# EAGLE design emg-bridge (EAGLE 6.5.0)
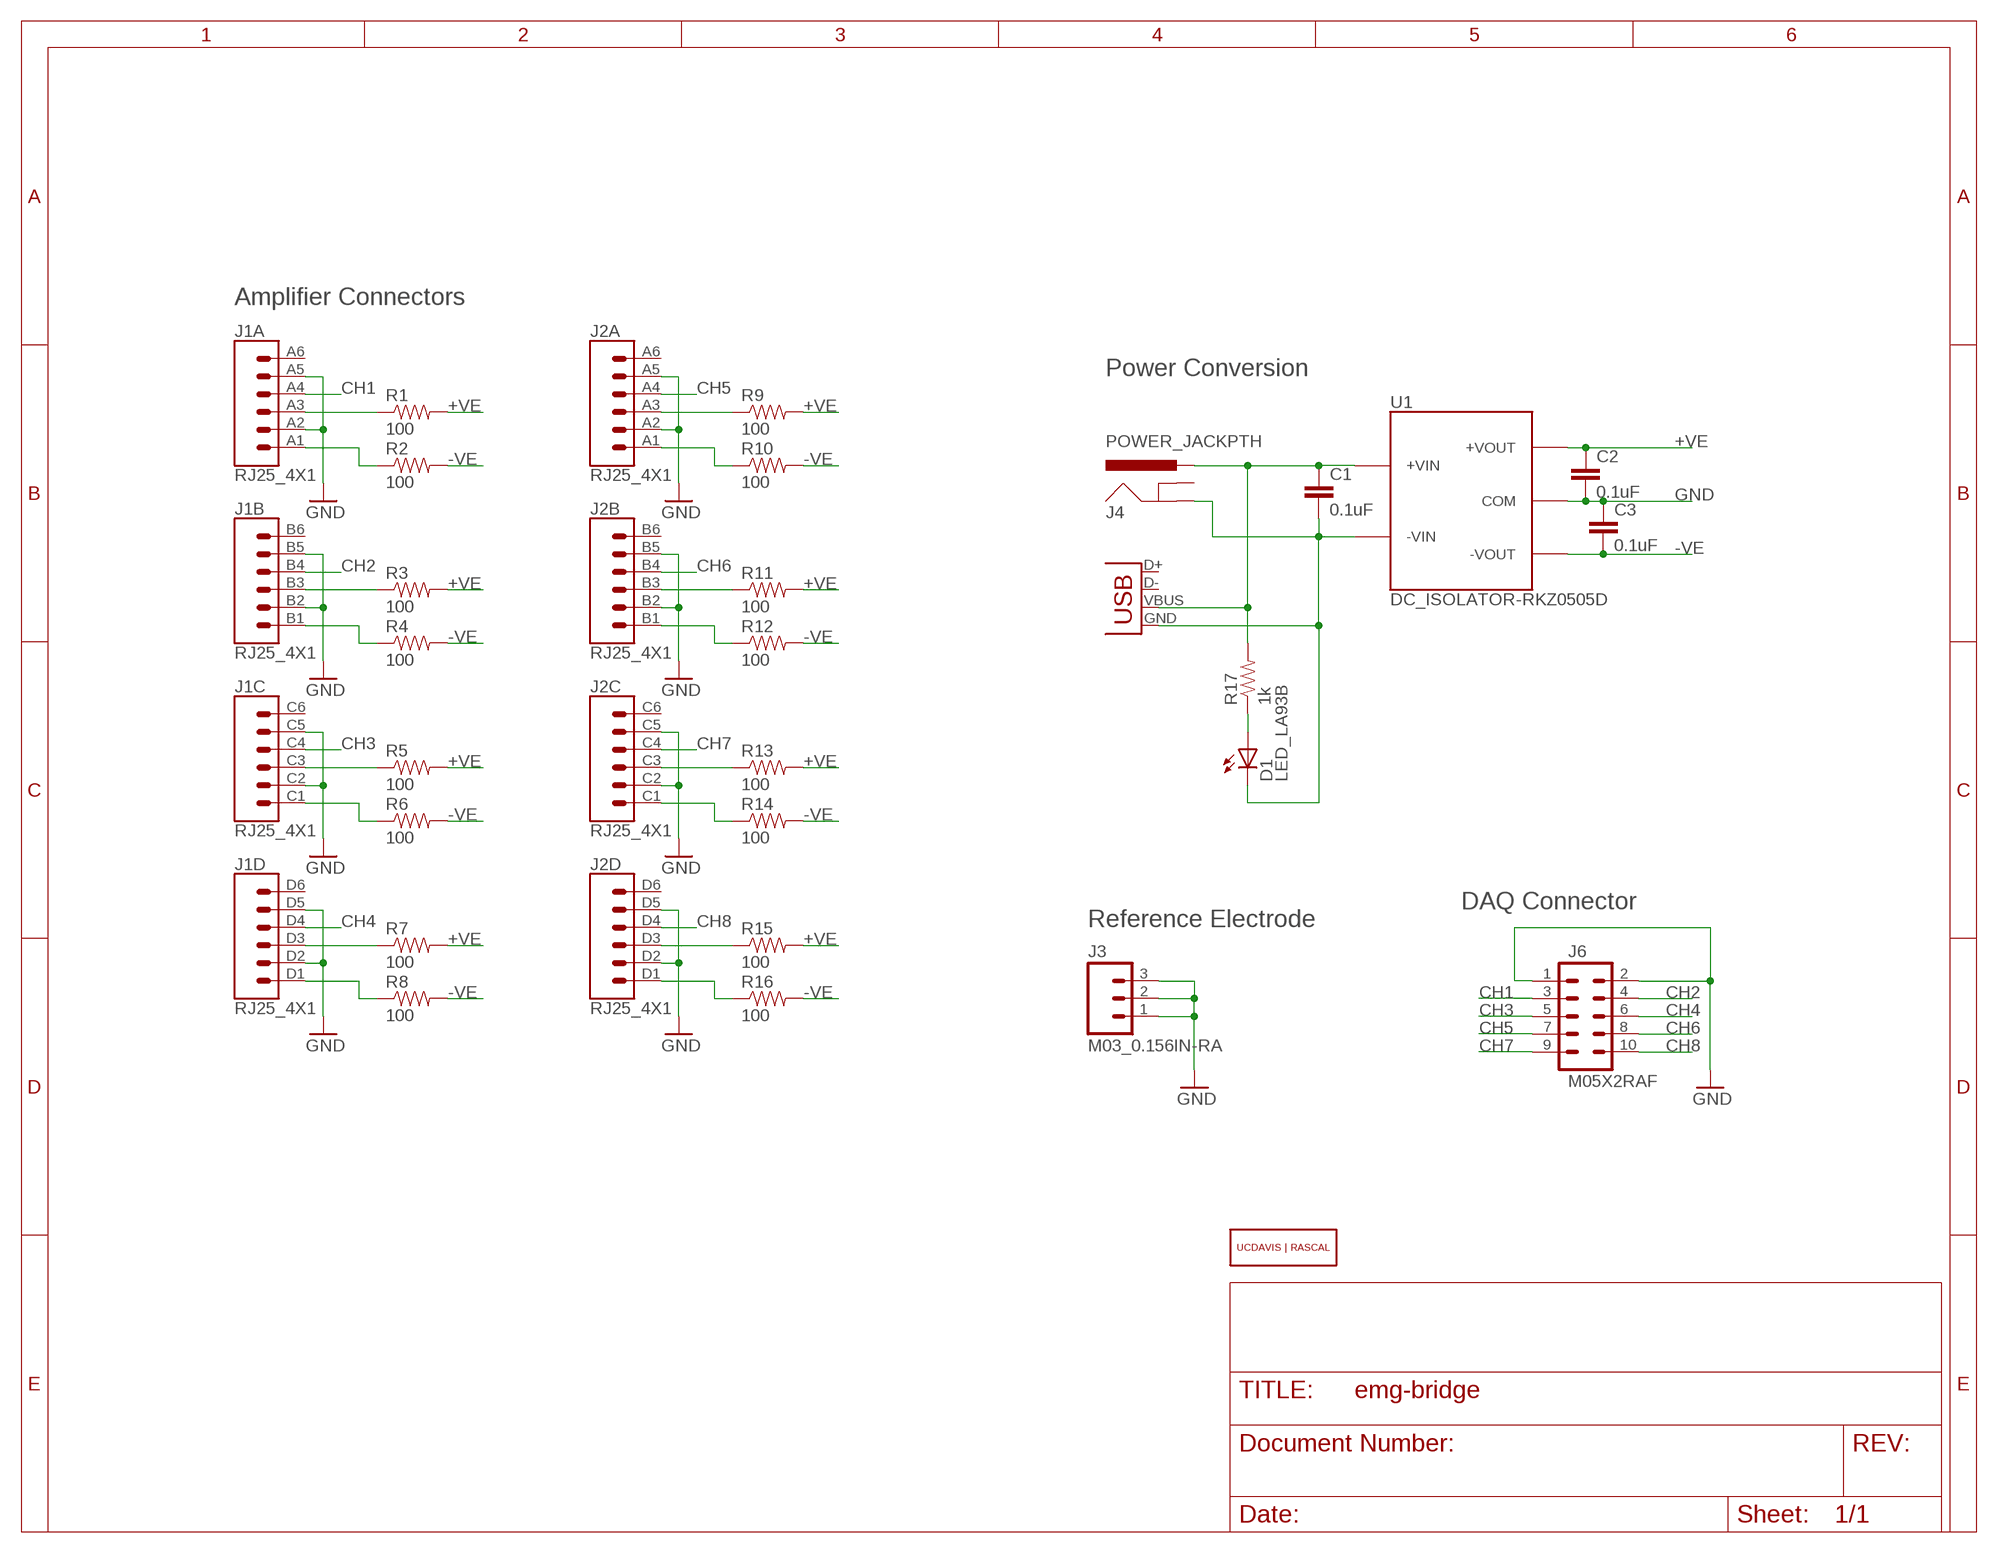
[diagram p0: schematic, sheet 1]

## Parts
C1  0.1uF  CAP0805  [0805]
C2  0.1uF  CAP0805  [0805]
C3  0.1uF  CAP0805  [0805]
D1  LED_LA93B  [LED_RA]
J1  RJ25_4X1  [RJ25_4X1]
J2  RJ25_4X1  [RJ25_4X1]
J3  M03_0.156IN-RA  [TE_640389-3]
J4  POWER_JACKPTH  [POWER_JACK_PTH]
J5  USB-B  USBPTH  [USB-B-PTH]
J6  M05X2RAF  [2X5-RAF]
R1  100  RESISTOR0805-RES  [0805]
R2  100  RESISTOR0805-RES  [0805]
R3  100  RESISTOR0805-RES  [0805]
R4  100  RESISTOR0805-RES  [0805]
R5  100  RESISTOR0805-RES  [0805]
R6  100  RESISTOR0805-RES  [0805]
R7  100  RESISTOR0805-RES  [0805]
R8  100  RESISTOR0805-RES  [0805]
R9  100  RESISTOR0805-RES  [0805]
R10  100  RESISTOR0805-RES  [0805]
R11  100  RESISTOR0805-RES  [0805]
R12  100  RESISTOR0805-RES  [0805]
R13  100  RESISTOR0805-RES  [0805]
R14  100  RESISTOR0805-RES  [0805]
R15  100  RESISTOR0805-RES  [0805]
R16  100  RESISTOR0805-RES  [0805]
R17  1k  RESISTOR0805-RES  [0805]
U1  DC_ISOLATOR-RKZ0505D  [SIP7]
U$1  UCDAVIS-RASCAL_LOGO-2LINE  [UCDAVIS-RASCAL_LOGO]

## Nets
+VE: C2.1 R1.2 R3.2 R5.2 R7.2 R9.2 R11.2 R13.2 R15.2 U1.7(+VOUT)
-VE: C3.2 R2.2 R4.2 R6.2 R8.2 R10.2 R12.2 R14.2 R16.2 U1.5(-VOUT)
CH1: J1.A4 J6.3
CH2: J1.B4 J6.4
CH3: J1.C4 J6.5
CH4: J1.D4 J6.6
CH5: J2.A4 J6.7
CH6: J2.B4 J6.8
CH7: J2.C4 J6.9
CH8: J2.D4 J6.10
DGND: C1.2 D1.K(C) J4.GND J5.GND U1.2(-VIN)
GND: C2.2 C3.1 J1.A2 J1.A5 J1.B2 J1.B5 J1.C2 J1.C5 J1.D2 J1.D5 J2.A2 J2.A5 J2.B2 J2.B5 J2.C2 J2.C5 J2.D2 J2.D5 J3.1 J3.2 J3.3 J6.1 J6.2 U1.6(COM)
N$1: J1.A1 R2.1
N$2: C1.1 J4.PWR J5.VBUS R17.2 U1.1(+VIN)
N$3: J1.A3 R1.1
N$4: D1.A R17.1
N$6: J1.B1 R4.1
N$8: J1.B3 R3.1
N$11: J1.C1 R6.1
N$13: J1.C3 R5.1
N$16: J1.D1 R8.1
N$18: J1.D3 R7.1
N$21: J2.A1 R10.1
N$23: J2.A3 R9.1
N$26: J2.B1 R12.1
N$28: J2.B3 R11.1
N$31: J2.C1 R14.1
N$33: J2.C3 R13.1
N$36: J2.D1 R16.1
N$38: J2.D3 R15.1
Unconnected: J1.A6 J1.B6 J1.C6 J1.D6 J2.A6 J2.B6 J2.C6 J2.D6 J4.GNDBREAK J5.D+ J5.D-

## Notes on the sheet
- Amplifier Connectors
- Power Conversion
- DAQ Connector
- Reference Electrode

## Library data of the parts
C1-C3 = SparkFun-Capacitors:CAP: Capacitor Standard 0603 ceramic capacitor, and 0.1" leaded capacitor.
D1 = eagle-lib:LED: 5mm right angle LED in a housing. Jameco PN: LA93B/G-1
J1 J2 = eagle-lib:RJ25_4X1: 4x1 block of 6p6c (RJ25, also fits RJ11, RJ12, RJ14) jacks.
J3 = eagle-lib:M03: 1x3 row of header pins.
J4 = SparkFun-Connectors:POWER_JACK: Power Jack This is the standard 5.5mm barrel jack for power. The PTH is the most common, proven, reliable, footprint. The Slot footprint only works if the mill layer is transmitted to the PCB fab house so be warned. Spark Fun Electronics SKU : PRT-00119 SMT: CONN-08106 Mating wall wart : TOL-00298 (and others)
J5 = SparkFun-Connectors:USB: USB Connectors USB-B-PTH is fully proven SKU : PRT-00139/CONN-08278 USB-miniB is fully proven SKU : PRT-00587 USB-A-PCB is untested. USB-A-H is throughly reviewed, but untested. Spark Fun Electronics SKU : PRT-00437 USB-B-SMT is throughly reviewed, but untested. Needs silkscreen touching up. USB-A-S has not been used/tested USB-MB-H has not been used/tested USB-MICROB has been used. CONN-09505; PROD_ID: CONN-08278
J6 = SparkFun-Connectors:M05X2: Header 5x2 Standard 10-pin dual row 0.1" header. Commonly used with AVR-ISP. Use with Spark Fun Electronics SKU: PRT-00778
R1-R17 = SparkFun-Passives:RESISTOR: Resistor Basic schematic elements and footprints for 0603, 1206, and PTH resistors.
U1 = eagle-lib:DC_ISOLATOR: DC-DC converter and isolator. Recom RKZ-0505D DC-DC converter and isolator. Takes 5V and provides 3kV-isolated +/- 5V. Digikey PN: 945-1200-ND Manfacturer PN: RKZ-0505D
U$1 = ucdrascal-eagle-lib:UCDAVIS-RASCAL_LOGO

## Board
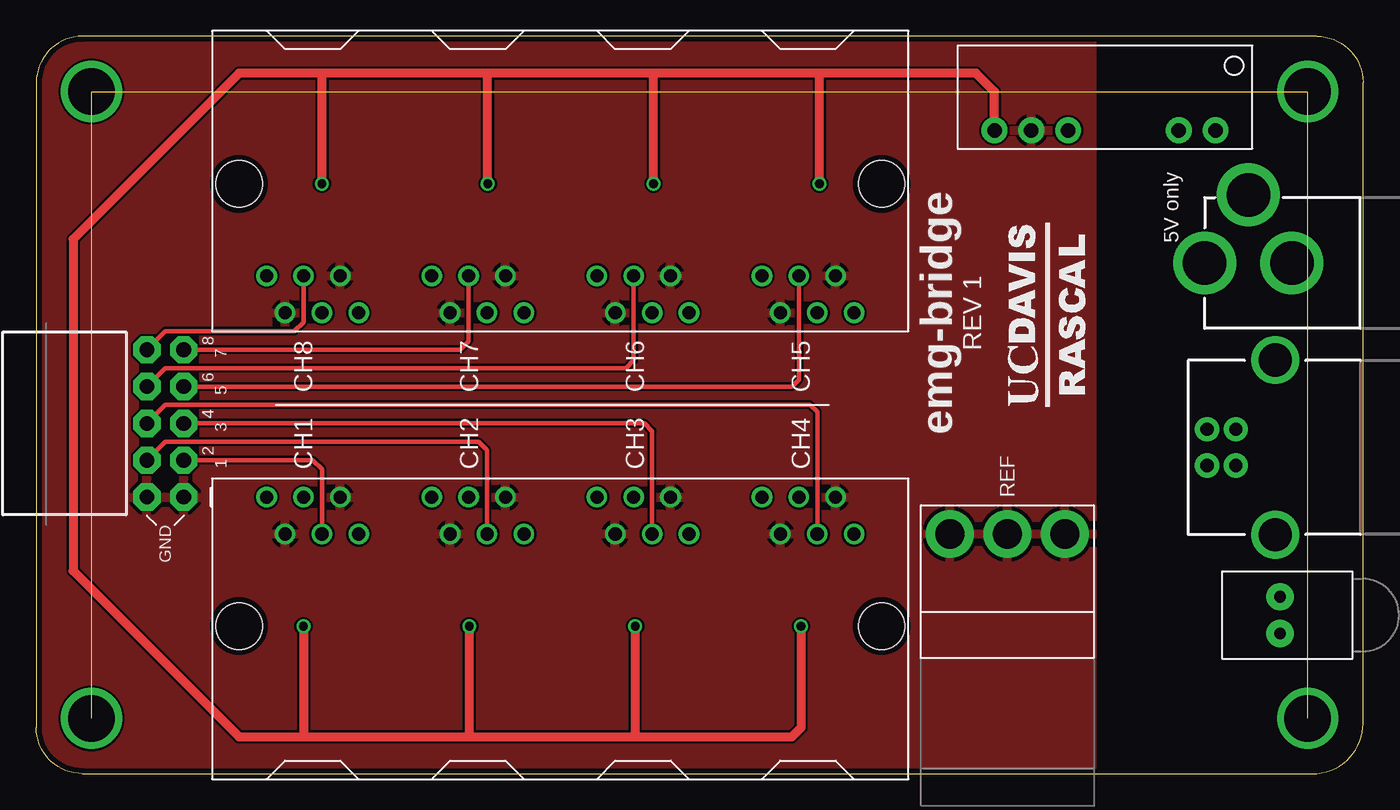
[diagram p1: board, top side]
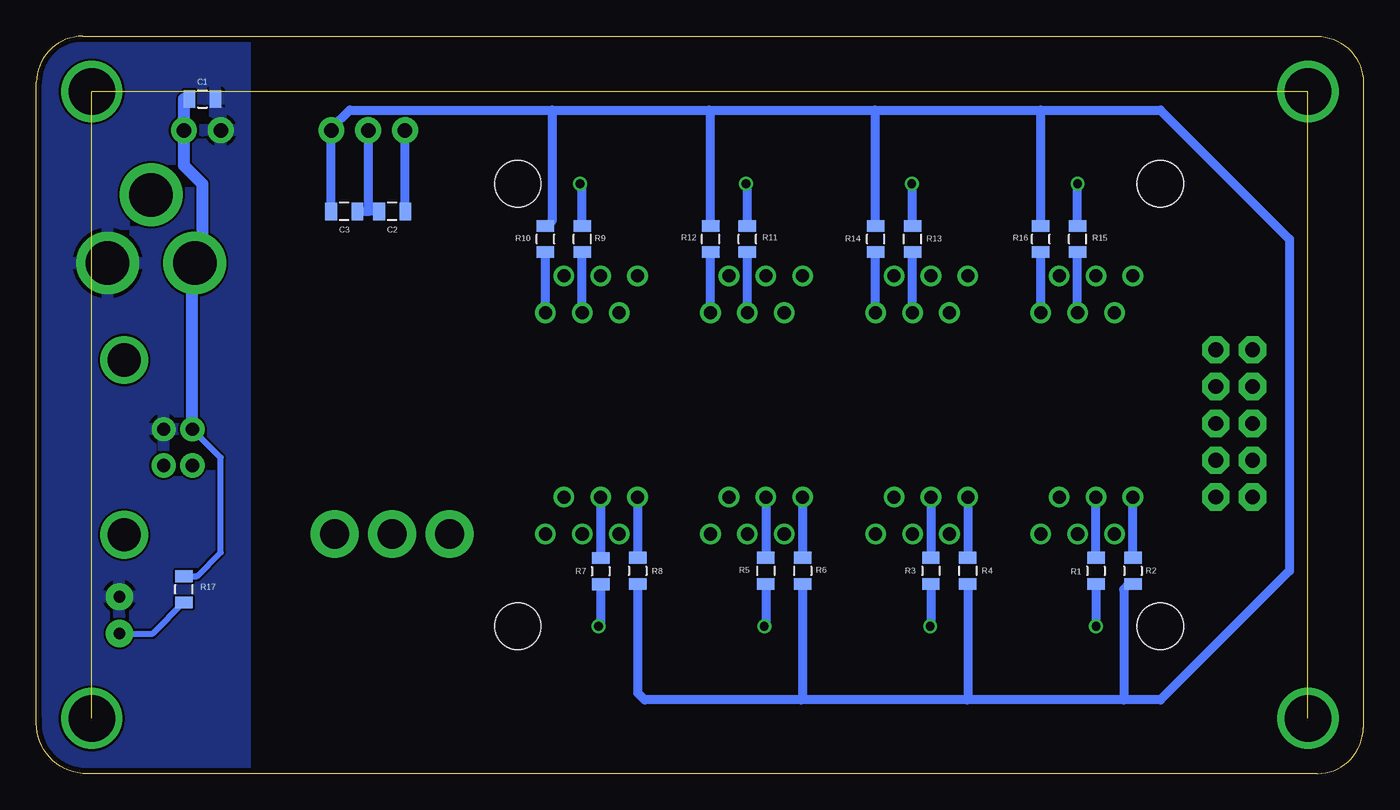
[diagram p2: board, bottom side, seen from below]

Size 91.45 x 50.8 mm. Coordinates in mm from the lower left corner, seen from the top.
Outline: 3.17,0 88.27,0 arc90 91.44,3.81 91.44,47.62 arc90 88.27,50.8 3.17,50.8 arc90 0,47.62 0,3.17 arc90 3.17,0
Copper layers (1*16): Top 0.0356mm / dielectric 1.5011mm / Bottom 0.0356mm
Design rules "LaenPCBOrder": minimum track width 6mil, minimum drill 13mil, track to track 6mil, track to pad 6mil, pad to pad 6mil, via to via 6mil, smd to smd 6mil, copper to edge 15mil, drill to drill 6mil, minimum pad ring 7mil, minimum via ring 7mil, stop-mask expansion 4mil, vias tented up to drill 0mil, thermal gap 10mil

### Footprints (pad centres in the part's own frame; a part is rotated, then mirrored left to right if it is on the bottom)
0805 = smd 0.8 x 1.2: 1 -0.9,0; 2 0.9,0
LED_RA = drill 0.813 pad 1.88: A -1.27,0; K 1.27,0
RJ25_4X1 = drill 0.9 pad 1.422: A1 1.905,8.89; A2 3.175,6.35; A3 4.445,8.89; A4 5.715,6.35; A5 6.985,8.89; A6 8.255,6.35; B1 13.284,8.89; B2 14.554,6.35; B3 15.824,8.89; B4 17.094,6.35; B5 18.364,8.89; B6 19.634,6.35; C1 24.663,8.89; C2 25.933,6.35; C3 27.203,8.89; C4 28.473,6.35; C5 29.743,8.89; C6 31.013,6.35; D1 36.043,8.89; D2 37.313,6.35; D3 38.583,8.89; D4 39.853,6.35; D5 41.123,8.89; D6 42.393,6.35 | hole 3.2: 0,0; 44.298,0
TE_640389-3 = drill 2 pad 3.302: 1 3.962,0; 2 0,0; 3 -3.962,0
POWER_JACK_PTH = drill 2.997 pad 4.318: GND 0,7.7; GNDBREAK 4.7,10.7; PWR 0,13.7
USB-B-PTH = drill 0.914 pad 1.676: D+ 0,1.25; D- 1.981,1.25; GND 0,-1.25; VBUS 1.981,-1.25 | drill 2.286: S1 -2.718,-6.02; S2 -2.718,6.02
2X5-RAF = drill 1.016 pad 1.88 octagon: 1 -1.27,5.08; 2 1.27,5.08; 3 -1.27,2.54; 4 1.27,2.54; 5 -1.27,0; 6 1.27,0; 7 -1.27,-2.54; 8 1.27,-2.54; 9 -1.27,-5.08; 10 1.27,-5.08
SIP7 = drill 1 pad 1.778: 1 0,0; 2 2.54,0; 5 10.16,0; 6 12.7,0; 7 15.24,0

### Placement (x,y rotation side)
C1  80.01,46.48 0 bottom
C2  66.93,38.73 180 bottom
C3  70.23,38.73 180 bottom
D1  85.72,10.92 90 top
J1  13.97,10.16 0 top
J2  58.27,40.64 180 top
J3  66.93,16.51 180 top
J4  94.23,35.18 90 top
J5  82.68,22.48 180 top
J6  8.89,24.13 180 top
R1  18.41,13.97 270 bottom
R2  15.88,13.97 270 bottom
R3  29.79,13.97 270 bottom
R4  27.25,13.97 270 bottom
R5  41.17,13.97 270 bottom
R6  38.63,13.97 270 bottom
R7  52.55,13.94 270 bottom
R8  50.01,13.97 270 bottom
R9  53.82,36.83 90 bottom
R10  56.36,36.83 90 bottom
R11  42.44,36.83 90 bottom
R12  44.98,36.83 90 bottom
R13  31.06,36.83 90 bottom
R14  33.6,36.83 90 bottom
R15  19.68,36.83 90 bottom
R16  22.23,36.83 90 bottom
R17  81.28,12.7 90 bottom
U1  81.28,44.32 180 top
U$1  69.72,31.62 90 top

### Tracks (layer width: path | path; a pad name or v marks a point on that pad's centre or on a via)
+VE  (via drill 0.6)
  Top 0.61: U1.7 66.04,46.99 64.77,48.26 53.98,48.26 | 53.98,48.26 42.55,48.26 | 42.55,48.26 31.11,48.26 | 31.11,48.26 19.68,48.26 | 19.68,48.26 13.97,48.26 2.54,36.83 2.54,13.97 13.97,2.54 18.41,2.54 | 18.41,2.54 29.84,2.54 | 29.84,2.54 41.27,2.54 | 41.27,2.54 52.07,2.54 52.7,3.17 v52.7,10.16 | v41.27,10.16 41.27,2.54 | v29.84,10.16 29.84,2.54 | v18.41,10.16 18.41,2.54 | v19.68,40.64 19.68,48.26 | v31.11,40.64 31.11,48.26 | v42.55,40.64 42.55,48.26 | v53.98,40.64 53.98,48.26
  Bottom 0.61: R5.2 41.17,10.26 v41.27,10.16 | R7.2 52.55,10.31 v52.7,10.16 | R3.2 29.79,10.21 v29.84,10.16 | R1.2 v18.41,10.16 | R15.2 v19.68,40.64 | R13.2 31.06,40.59 v31.11,40.64 | R11.2 42.44,40.54 v42.55,40.64 | R9.2 53.82,40.49 v53.98,40.64 | C2.1 U1.7
-VE
  Bottom 0.61: 55.88,45.72 69.85,45.72 71.12,44.45 U1.5 C3.2 | 55.88,45.72 45.09,45.72 | 45.09,45.72 33.66,45.72 | 33.66,45.72 22.23,45.72 | 22.23,45.72 13.97,45.72 5.08,36.83 5.08,13.97 13.97,5.08 16.51,5.08 | 16.51,5.08 27.3,5.08 | 27.3,5.08 38.73,5.08 | 38.73,5.08 49.53,5.08 50.01,5.56 R8.2 | R6.2 38.63,5.18 38.73,5.08 | R4.2 27.25,5.13 27.3,5.08 | R2.2 16.14,13.07 16.51,12.7 16.51,5.08 | R16.2 22.23,45.72 | R14.2 33.6,45.67 33.66,45.72 | R12.2 44.98,45.62 45.09,45.72 | R10.2 56.25,37.73 55.88,38.1 55.88,45.72
CH1
  Top 0.305: J1.A4 19.68,20.95 19.05,21.59 J6.3
CH2
  Top 0.305: J1.B4 31.06,22.28 30.48,22.86 8.89,22.86 J6.4
CH3
  Top 0.305: J1.C4 42.44,23.6 41.91,24.13 J6.5
CH4
  Top 0.305: J1.D4 53.82,24.92 53.34,25.4 8.89,25.4 J6.6
CH5
  Top 0.305: J2.A4 52.55,27.15 52.07,26.67 J6.7
CH6
  Top 0.305: J2.B4 41.17,28.47 40.64,27.94 8.89,27.94 J6.8
CH7
  Top 0.305: J2.C4 29.79,29.79 29.21,29.21 J6.9
CH8
  Top 0.305: J2.D4 18.41,31.11 17.78,30.48 8.89,30.48 J6.10
DGND
  pour Bottom: 77.09,50.8 77.09,0 91.44,0 91.44,50.8
GND
  Bottom 0.61: U1.6 68.58,38.73 | C3.1 68.58,38.73 | C2.2 68.58,38.73
  pour Top: 0,0 72.77,0 72.77,50.8 0,50.8
N$1
  Bottom 0.61: R2.1 J1.A1
N$2
  Bottom 0.406: R17.2 80.38,13.6 78.74,15.24 78.74,21.77 J5.VBUS
  Bottom 0.813: J5.VBUS 80.7,35.02 J4.PWR 80.01,35.7 80.01,40.64 81.28,41.91 U1.1 81.28,46.48 C1.1
N$3
  Bottom 0.61: R1.1 J1.A3
N$4
  Bottom 0.406: D1.A 83.43,9.65 R17.1
N$5  (via drill 3.2 pad 3.81)  (3 unrouted)
  other vias: 3.81,46.99 3.81,3.81 87.63,46.99 87.63,3.81
N$6
  Bottom 0.61: J1.B1 R4.1
N$8
  Bottom 0.61: J1.B3 R3.1
N$11
  Bottom 0.61: J1.C1 R6.1
N$13
  Bottom 0.61: J1.C3 R5.1
N$16
  Bottom 0.61: J1.D1 R8.1
N$18
  Bottom 0.61: J1.D3 R7.1
N$21
  Bottom 0.61: J2.A1 R10.1
N$23
  Bottom 0.61: J2.A3 R9.1
N$26
  Bottom 0.61: J2.B1 R12.1
N$28
  Bottom 0.61: J2.B3 R11.1
N$31
  Bottom 0.61: J2.C1 R14.1
N$33
  Bottom 0.61: J2.C3 R13.1
N$36
  Bottom 0.61: J2.D1 R16.1
N$38
  Bottom 0.61: J2.D3 R15.1

### Text on the board
tPlace: 5V only | emg-bridge | REV 1 | 8 | CH8 | CH7 | CH6 | CH5 | 7 | 6 | 5 | 4 | 3 | 2 | 1 | CH1 | CH2 | CH3 | CH4 | REF | GND